# Altium schematic sheet USB_HS_PHY.SchDoc
size A4
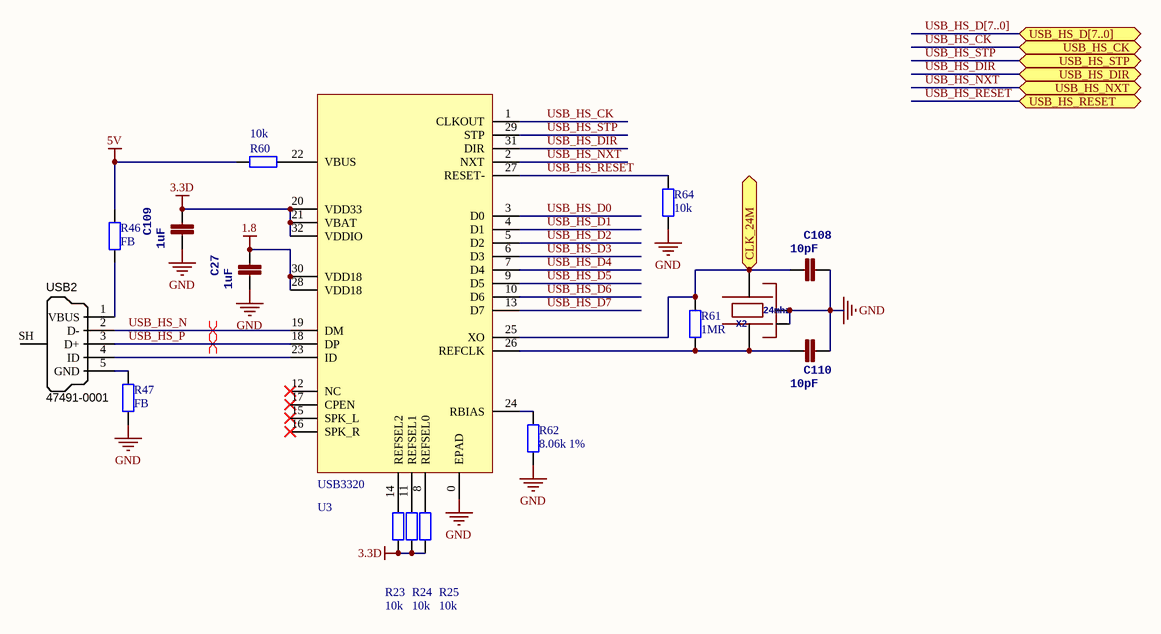
[diagram p0: USB_HS_PHY.SchDoc]

## Parts
C27  1uF  [0402]
C108  10pF  [0402]
C109  1uF  [0402]
C110  10pF  [0402]
R23  10k  [0402]
R24  10k  [0402]
R25  10k  [0402]
R46  FB  [0603]
R47  FB  [0603]
R60  10k  [0402]
R61  1MR  [0402]
R62  8.06k 1%  [0402]
R64  10k  [0402]
U3  USB3320  [USB3300]
USB2  Manufacturer Part Number 1: 47491-0001  [MICRO-YZX]  (hidden comment: USB Micro Type B)
X2  24mhz  [OSCILLATOR-3.2X2.5]

## Ports
CLK_24M, USB_HS_CK, USB_HS_D[7..0], USB_HS_DIR, USB_HS_NXT, USB_HS_RESET, USB_HS_STP

## Nets
1.8: C27.1 U3.28(VDD18) U3.30(VDD18)
3.3D: C109.1 R23.2 R24.2 R25.2 U3.20(VDD33) U3.21(VBAT) U3.32(VDDIO)
5V: R46.1 R60.1
GND: C27.2 C108.1 C109.2 C110.1 R47.2 R62.1 R64.2 U3.0(EPAD) X2.2(NC_2) X2.4(NC_4)
CLK_24M: C108.2 R61.2 U3.25(XO) X2.3 ; port CLK_24M
USB_HS_CK: U3.1(CLKOUT) ; port USB_HS_CK
USB_HS_D0: U3.3(D0)
USB_HS_D1: U3.4(D1)
USB_HS_D2: U3.5(D2)
USB_HS_D3: U3.6(D3)
USB_HS_D4: U3.7(D4)
USB_HS_D5: U3.9(D5)
USB_HS_D6: U3.10(D6)
USB_HS_D7: U3.13(D7)
USB_HS_DIR: U3.31(DIR) ; port USB_HS_DIR
USB_HS_N: U3.19(DM) USB2.2(D-)
USB_HS_NXT: U3.2(NXT) ; port USB_HS_NXT
USB_HS_P: U3.18(DP) USB2.3(D+)
USB_HS_RESET: R64.1 U3.27(RESET-) ; port USB_HS_RESET
USB_HS_STP: U3.29(STP) ; port USB_HS_STP
NetC110_2: C110.2 R61.1 U3.26(REFCLK) X2.1
NetR23_1: R23.1 U3.14(REFSEL2)
NetR24_1: R24.1 U3.11(REFSEL1)
NetR25_1: R25.1 U3.8(REFSEL0)
NetR46_2: R46.2 USB2.1(VBUS)
NetR47_1: R47.1 USB2.5(GND)
NetR60_2: R60.2 U3.22(VBUS)
NetR62_2: R62.2 U3.24(RBIAS)
NetU3_23: U3.23(ID) USB2.4(ID)

Not connected (* = marked no-connect by the designer): U3 12(NC)* 15(SPK_L)* 16(SPK_R)* 17(CPEN)*; USB2 SH(Shell)

## Buses and harness runs
bus USB_HS_D[7..0] = port USB_HS_D[7..0]

## Layout directives
differential pair: USB_HS_N, USB_HS_P

## Library data of the parts
C27 C108-C110 = CAP0402-CAP: <b>Capacitor</b> / Standard 0603 ceramic capacitor, and 0.1" leaded capacitor.; PARTNO: CC0402ZRY5V7BB104
R23-R25 R46 R47 R60-R62 R64 = Res2: Resistor; Value: 0Ohm; Published: 8-Jun-2000; LatestRevisionDate: 17-Jul-2002; LatestRevisionNote: Re-released for DXP Platform.; PackageReference: AXIAL-0.4; Publisher: Altium Limited; PackageDescription: Axial Device, Thru-Hole; 2 Leads; 0.4 in Pin Spacing
USB2 = USB_Micro_TypeB: Connector SMD USB Micro Type B middle mount; Manufacturer 1: Molex Inc; SCDType: undef; Package / Case: SMD; Supplier 1: Digi-Key; Supplier Part Number 1: WM17142CT-ND
X2 = OSCILLATOR-3.2X2.5: Crystal Oscillator in 3.2x2.5 SMD